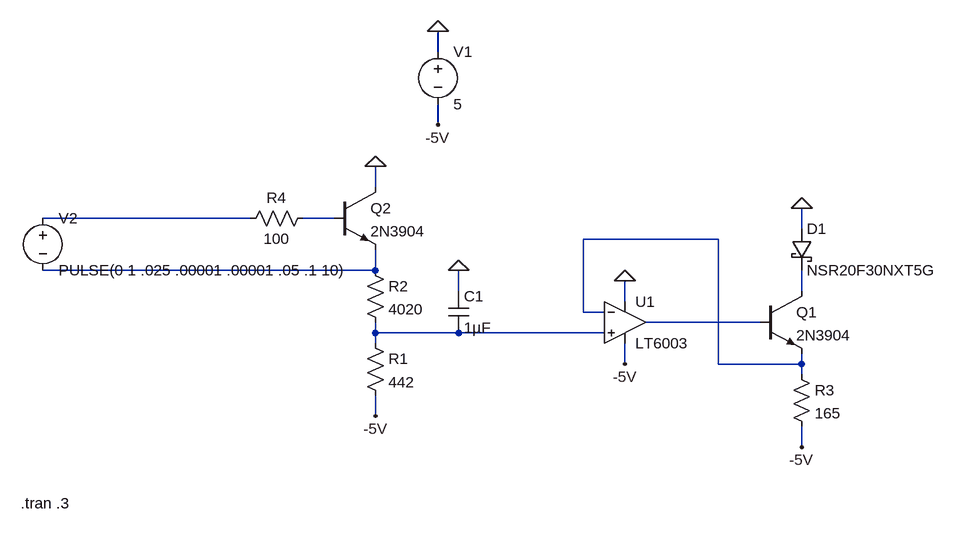
[diagram p0: schematic SupplySimulationNegative.asc]
SupplySimulationNegative.asc, the LTspice schematic file:
Version 4
SHEET 1 880 680
WIRE 32 -256 32 -288
WIRE 32 -144 32 -176
WIRE -64 -48 -64 -80
WIRE -256 0 -576 0
WIRE -128 0 -176 0
WIRE 592 16 592 -16
WIRE 464 32 256 32
WIRE -64 80 -64 48
WIRE -64 80 -576 80
WIRE 64 112 64 80
WIRE 592 112 592 80
WIRE 320 128 320 96
WIRE 256 144 256 32
WIRE 288 144 256 144
WIRE 528 160 352 160
WIRE -64 176 -64 160
WIRE 64 176 -64 176
WIRE 288 176 64 176
WIRE -64 192 -64 176
WIRE 320 224 320 192
WIRE 464 224 464 32
WIRE 592 224 592 208
WIRE 592 224 464 224
WIRE 592 240 592 224
WIRE -64 304 -64 272
WIRE 592 352 592 320
FLAG 592 -16 0
FLAG 32 -288 0
FLAG 32 -144 -5V
FLAG 320 224 -5V
FLAG 320 96 0
FLAG 592 352 -5V
FLAG -64 -80 0
FLAG -64 304 -5V
FLAG 64 80 0
SYMBOL Opamps\\LT6003 320 160 R0
SYMATTR InstName U1
SYMBOL res -80 176 R0
SYMATTR InstName R1
SYMATTR Value 442
SYMBOL res -80 64 R0
SYMATTR InstName R2
SYMATTR Value 4020
SYMBOL res 576 224 R0
SYMATTR InstName R3
SYMATTR Value 165
SYMBOL npn 528 112 R0
SYMATTR InstName Q1
SYMATTR Value 2N3904
SYMBOL schottky 576 16 R0
SYMATTR InstName D1
SYMATTR Value NSR20F30NXT5G
SYMATTR Description Diode
SYMATTR Type diode
SYMBOL voltage 32 -272 R0
WINDOW 123 0 0 Left 2
WINDOW 39 0 0 Left 2
SYMATTR InstName V1
SYMATTR Value 5
SYMBOL voltage -576 -16 R0
WINDOW 123 0 0 Left 2
WINDOW 39 0 0 Left 2
SYMATTR InstName V2
SYMATTR Value PULSE(0 1 .025 .00001 .00001 .05 .1 10)
SYMBOL npn -128 -48 R0
SYMATTR InstName Q2
SYMATTR Value 2N3904
SYMBOL res -160 -16 R90
WINDOW 0 0 56 VBottom 2
WINDOW 3 32 56 VTop 2
SYMATTR InstName R4
SYMATTR Value 100
SYMBOL cap 48 112 R0
SYMATTR InstName C1
SYMATTR Value 1µF
TEXT -610 438 Left 2 !.tran .3

The netlist it stands for:
* SupplySimulationNegative.asc
* U1: LT6003 (symbol Opamps\LT6003 not available, pins judged from their places): In+=N007 In-=N003 V+=0 V-=-5V OUT=N006
R1 N007 -5V 442
R2 N004 N007 4020
R3 N003 -5V 165
Q1 N005 N006 N003 0 2N3904
D1 0 N005 NSR20F30NXT5G
V1 0 -5V 5
V2 N001 N004 PULSE(0 1 .025 .00001 .00001 .05 .1 10)
Q2 0 N002 N004 0 2N3904
R4 N002 N001 100
C1 0 N007 1µF
.model D D
.lib standard.dio
.model NPN NPN
.model PNP PNP
.lib standard.bjt
.tran .3
.backanno
.end